# Altium schematic sheet FPCs.SchDoc
size A; SheetNumber: 5; SheetTotal: 9
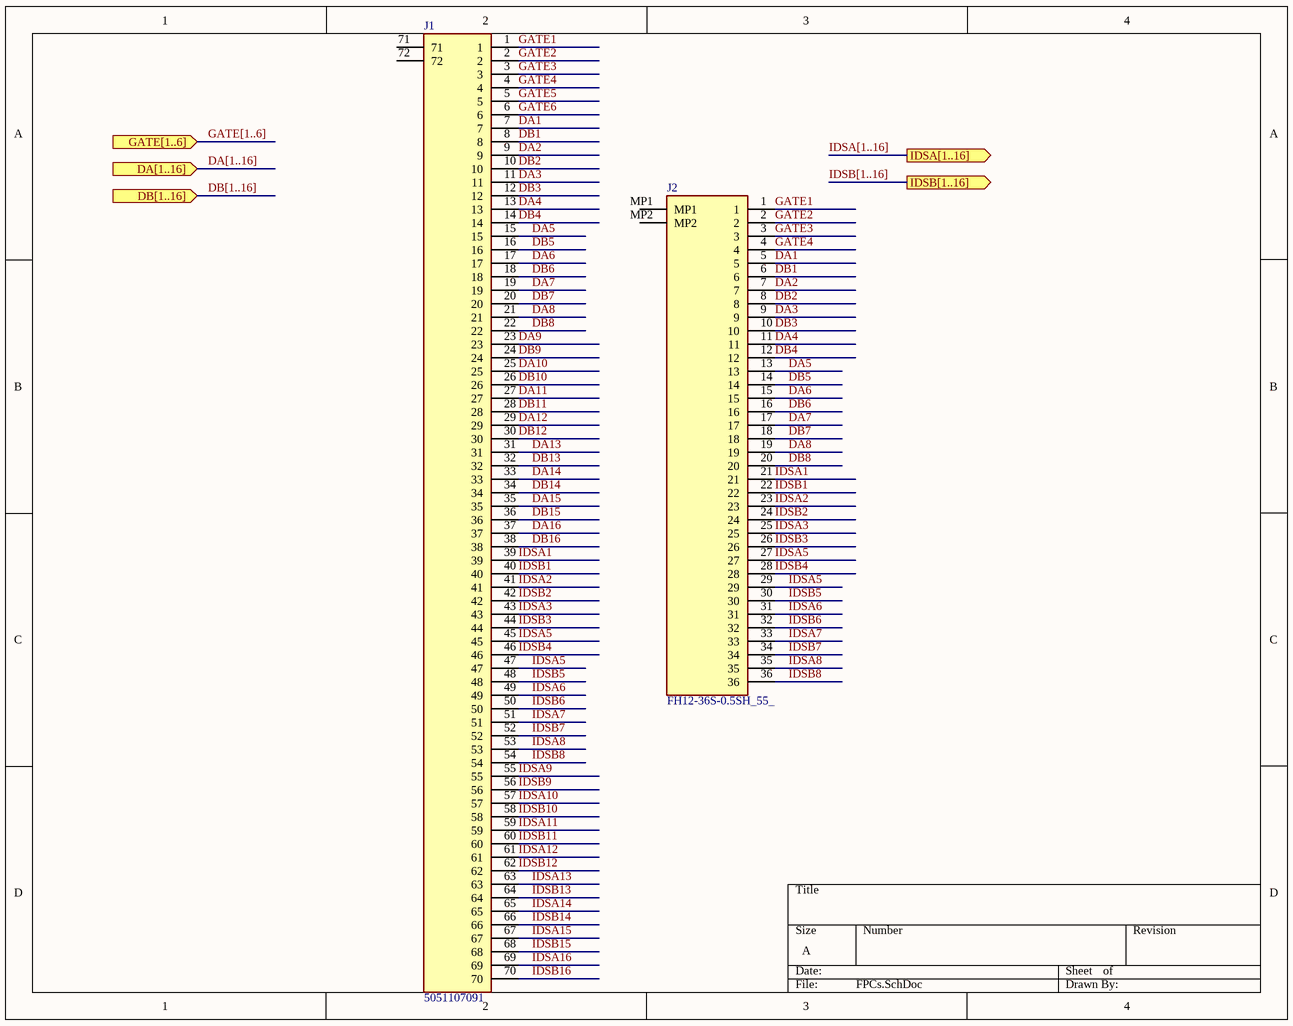
[diagram p0: FPCs.SchDoc]

## Parts
J1  5051107091  [5051107091]
J2  FH12-36S-0.5SH_55_  [FH1236S05SH55]

## Ports
DA[1..16] (in), DB[1..16] (in), GATE[1..6] (in), IDSA[1..16] (out), IDSB[1..16] (out)

## Nets
DA1: J1.7 J2.5
DA2: J1.9 J2.7
DA3: J1.11 J2.9
DA4: J1.13 J2.11
DA5: J1.15 J2.13
DA6: J1.17 J2.15
DA7: J1.19 J2.17
DA8: J1.21 J2.19
DA9: J1.23
DA10: J1.25
DA11: J1.27
DA12: J1.29
DA13: J1.31
DA14: J1.33
DA15: J1.35
DA16: J1.37
DB1: J1.8 J2.6
DB2: J1.10 J2.8
DB3: J1.12 J2.10
DB4: J1.14 J2.12
DB5: J1.16 J2.14
DB6: J1.18 J2.16
DB7: J1.20 J2.18
DB8: J1.22 J2.20
DB9: J1.24
DB10: J1.26
DB11: J1.28
DB12: J1.30
DB13: J1.32
DB14: J1.34
DB15: J1.36
DB16: J1.38
GATE1: J1.1 J2.1
GATE2: J1.2 J2.2
GATE3: J1.3 J2.3
GATE4: J1.4 J2.4
GATE5: J1.5
GATE6: J1.6
IDSA1: J1.39 J2.21
IDSA2: J1.41 J2.23
IDSA3: J1.43 J2.25
IDSA5: J1.45 J1.47 J2.27 J2.29
IDSA6: J1.49 J2.31
IDSA7: J1.51 J2.33
IDSA8: J1.53 J2.35
IDSA9: J1.55
IDSA10: J1.57
IDSA11: J1.59
IDSA12: J1.61
IDSA13: J1.63
IDSA14: J1.65
IDSA15: J1.67
IDSA16: J1.69
IDSB1: J1.40 J2.22
IDSB2: J1.42 J2.24
IDSB3: J1.44 J2.26
IDSB4: J1.46 J2.28
IDSB5: J1.48 J2.30
IDSB6: J1.50 J2.32
IDSB7: J1.52 J2.34
IDSB8: J1.54 J2.36
IDSB9: J1.56
IDSB10: J1.58
IDSB11: J1.60
IDSB12: J1.62
IDSB13: J1.64
IDSB14: J1.66
IDSB15: J1.68
IDSB16: J1.70

Not connected (* = marked no-connect by the designer): J1 71 72; J2 MP1 MP2

## Buses and harness runs
bus DA[1..16] = port DA[1..16]
bus DB[1..16] = port DB[1..16]
bus GATE[1..6] = port GATE[1..6]
bus IDSA[1..16] = port IDSA[1..16]
bus IDSB[1..16] = port IDSB[1..16]

## Library data of the parts
J1 = 5051107091: Connector; Manufacturer_Name: Molex; Datasheet Link: https://www.molex.com/webdocs/datasheets/pdf/en-us/5051107091_FFC_FPC_CONNECTORS.pdf; Height: 2.1mm; Manufacturer_Part_Number: 5051107091; Arrow Part Number: 5051107091; Arrow Price/Stock: https://www.arrow.com/en/products/5051107091/molex?region=nac
J2 = FH12-36S-0.5SH_55_: Connector; Manufacturer_Name: Hirose; Manufacturer_Part_Number: FH12-36S-0.5SH(55); Datasheet Link: https://www.hirose.com/product/document?clcode=CL0586-0526-4-55&productname=FH12-36S-0.5SH(55)&series=FH12&documenttype=2DDrawing&lang=en&documentid=0000987484; Height: 2.2mm; Mouser Part Number: 798-FH12-36S-0.5SH55; Mouser Price/Stock: https://www.mouser.co.uk/ProductDetail/Hirose-Connector/FH12-36S-05SH55?qs=Ux3WWAnHpjBt9PREjhnzAA%3D%3D; Arrow Part Number: FH12-36S-0.5SH(55); Arrow Price/Stock: https://www.arrow.com/en/products/fh12-36s-0.5sh-55/hirose-electric